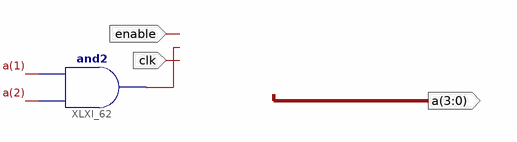
[diagram p0: schematic sheet 1]
// Xilinx ISE schematic Mod_6_Counter.sch (spartan3e) as structural Verilog: 1 symbols, 3 ports
module Mod_6_Counter (
  input  enable,
  input  clk,
  output [3:0] a
);

  wire XLXN_127;

  and XLXI_62 (XLXN_127, a[2], a[1]);
endmodule
